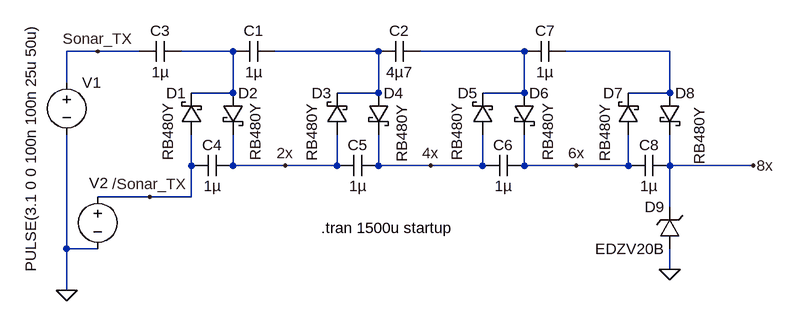
[diagram p0: schematic sonar charge pump.asc]
sonar charge pump.asc, the LTspice schematic file:
Version 4
SHEET 1 1024 680
WIRE -80 48 -128 48
WIRE -16 48 -80 48
WIRE 128 48 48 48
WIRE 352 48 192 48
WIRE 576 48 416 48
WIRE 800 48 640 48
WIRE -128 96 -128 48
WIRE 128 112 128 48
WIRE 128 112 64 112
WIRE 352 112 352 48
WIRE 352 112 288 112
WIRE 576 112 576 48
WIRE 576 112 512 112
WIRE 800 112 800 48
WIRE 800 112 736 112
WIRE 64 224 64 176
WIRE 128 224 128 176
WIRE 208 224 128 224
WIRE 288 224 288 176
WIRE 288 224 208 224
WIRE 352 224 352 176
WIRE 432 224 352 224
WIRE 512 224 512 176
WIRE 512 224 432 224
WIRE 576 224 576 176
WIRE 656 224 576 224
WIRE 736 224 736 176
WIRE 736 224 656 224
WIRE 800 224 800 176
WIRE 928 224 800 224
WIRE 0 272 -80 272
WIRE 64 272 64 224
WIRE 64 272 0 272
WIRE 800 288 800 224
WIRE -128 352 -128 176
WIRE -80 352 -128 352
WIRE 800 384 800 352
WIRE -128 416 -128 352
FLAG -128 416 0
FLAG -80 48 Sonar_TX
FLAG 208 224 2x
FLAG 432 224 4x
FLAG 656 224 6x
FLAG 928 224 8x
FLAG 800 384 0
FLAG 0 272 /Sonar_TX
SYMBOL schottky 80 176 R180
WINDOW 0 24 64 Left 2
WINDOW 3 -82 -40 VRight 2
SYMATTR InstName D1
SYMATTR Value RB480Y
SYMATTR Description Diode
SYMATTR Type diode
SYMBOL schottky 112 112 R0
WINDOW 3 -84 15 VRight 2
SYMATTR Value RB480Y
SYMATTR InstName D2
SYMATTR Description Diode
SYMATTR Type diode
SYMBOL schottky 304 176 R180
WINDOW 0 24 64 Left 2
WINDOW 3 55 48 VLeft 2
SYMATTR InstName D3
SYMATTR Value RB480Y
SYMATTR Description Diode
SYMATTR Type diode
SYMBOL schottky 336 112 R0
WINDOW 3 52 17 VRight 2
SYMATTR Value RB480Y
SYMATTR InstName D4
SYMATTR Description Diode
SYMATTR Type diode
SYMBOL schottky 528 176 R180
WINDOW 0 24 64 Left 2
WINDOW 3 56 -40 VRight 2
SYMATTR InstName D5
SYMATTR Value RB480Y
SYMATTR Description Diode
SYMATTR Type diode
SYMBOL schottky 560 112 R0
WINDOW 3 52 15 VRight 2
SYMATTR Value RB480Y
SYMATTR InstName D6
SYMATTR Description Diode
SYMATTR Type diode
SYMBOL cap 192 32 R90
WINDOW 0 0 32 VBottom 2
WINDOW 3 32 32 VTop 2
SYMATTR InstName C1
SYMATTR Value 1µ
SYMATTR SpiceLine V=20
SYMBOL cap 416 32 R90
WINDOW 0 0 32 VBottom 2
WINDOW 3 32 32 VTop 2
SYMATTR InstName C2
SYMATTR Value 4µ7
SYMATTR SpiceLine V=20
SYMBOL cap 48 32 R90
WINDOW 0 0 32 VBottom 2
WINDOW 3 32 32 VTop 2
SYMATTR InstName C3
SYMATTR Value 1µ
SYMATTR SpiceLine V=20
SYMBOL cap 128 208 R90
WINDOW 0 0 32 VBottom 2
WINDOW 3 32 32 VTop 2
SYMATTR InstName C4
SYMATTR Value 1µ
SYMATTR SpiceLine V=20
SYMBOL cap 352 208 R90
WINDOW 0 0 32 VBottom 2
WINDOW 3 32 32 VTop 2
SYMATTR InstName C5
SYMATTR Value 1µ
SYMATTR SpiceLine V=20
SYMBOL cap 576 208 R90
WINDOW 0 0 32 VBottom 2
WINDOW 3 32 32 VTop 2
SYMATTR InstName C6
SYMATTR Value 1µ
SYMATTR SpiceLine V=20
SYMBOL voltage -128 80 R0
WINDOW 3 -55 -77 VRight 2
WINDOW 123 0 0 Left 2
WINDOW 39 0 0 Left 2
SYMATTR Value PULSE(3.1 0 0 100n 100n 25u 50u)
SYMATTR InstName V1
SYMBOL cap 640 32 R90
WINDOW 0 0 32 VBottom 2
WINDOW 3 32 32 VTop 2
SYMATTR InstName C7
SYMATTR Value 1µ
SYMATTR SpiceLine V=20
SYMBOL schottky 752 176 R180
WINDOW 0 24 64 Left 2
WINDOW 3 52 -42 VRight 2
SYMATTR InstName D7
SYMATTR Value RB480Y
SYMATTR Description Diode
SYMATTR Type diode
SYMBOL schottky 784 112 R0
WINDOW 3 61 21 VRight 2
SYMATTR Value RB480Y
SYMATTR InstName D8
SYMATTR Description Diode
SYMATTR Type diode
SYMBOL cap 800 208 R90
WINDOW 0 0 32 VBottom 2
WINDOW 3 32 32 VTop 2
SYMATTR InstName C8
SYMATTR Value 1µ
SYMATTR SpiceLine V=20
SYMBOL voltage -80 256 R0
WINDOW 123 0 0 Left 2
WINDOW 39 0 0 Left 2
WINDOW 0 -13 -5 Left 2
WINDOW 3 -27 119 Invisible 2
SYMATTR InstName V2
SYMATTR Value PULSE(0 3.1 0 100n 100n 25u 50u)
SYMBOL zener 816 352 R180
WINDOW 0 24 64 Left 2
WINDOW 3 24 0 Left 2
SYMATTR InstName D9
SYMATTR Value EDZV20B
SYMATTR Description Diode
SYMATTR Type diode
TEXT 264 320 Left 2 !.tran 1500u startup

The netlist it stands for:
* sonar charge pump.asc
D1 /Sonar_TX N001 RB480Y
D2 N001 2x RB480Y
D3 2x N002 RB480Y
D4 N002 4x RB480Y
D5 4x N003 RB480Y
D6 N003 6x RB480Y
C1 N002 N001 1µ V=20
C2 N003 N002 4µ7 V=20
C3 N001 Sonar_TX 1µ V=20
C4 2x /Sonar_TX 1µ V=20
C5 4x 2x 1µ V=20
C6 6x 4x 1µ V=20
V1 Sonar_TX 0 PULSE(3.1 0 0 100n 100n 25u 50u)
C7 N004 N003 1µ V=20
D7 6x N004 RB480Y
D8 N004 8x RB480Y
C8 8x 6x 1µ V=20
V2 /Sonar_TX 0 PULSE(0 3.1 0 100n 100n 25u 50u)
D9 0 8x EDZV20B
.model D D
.lib standard.dio
.tran 1500u startup
.backanno
.end